# EAGLE design mech433 (EAGLE 9.4.0)
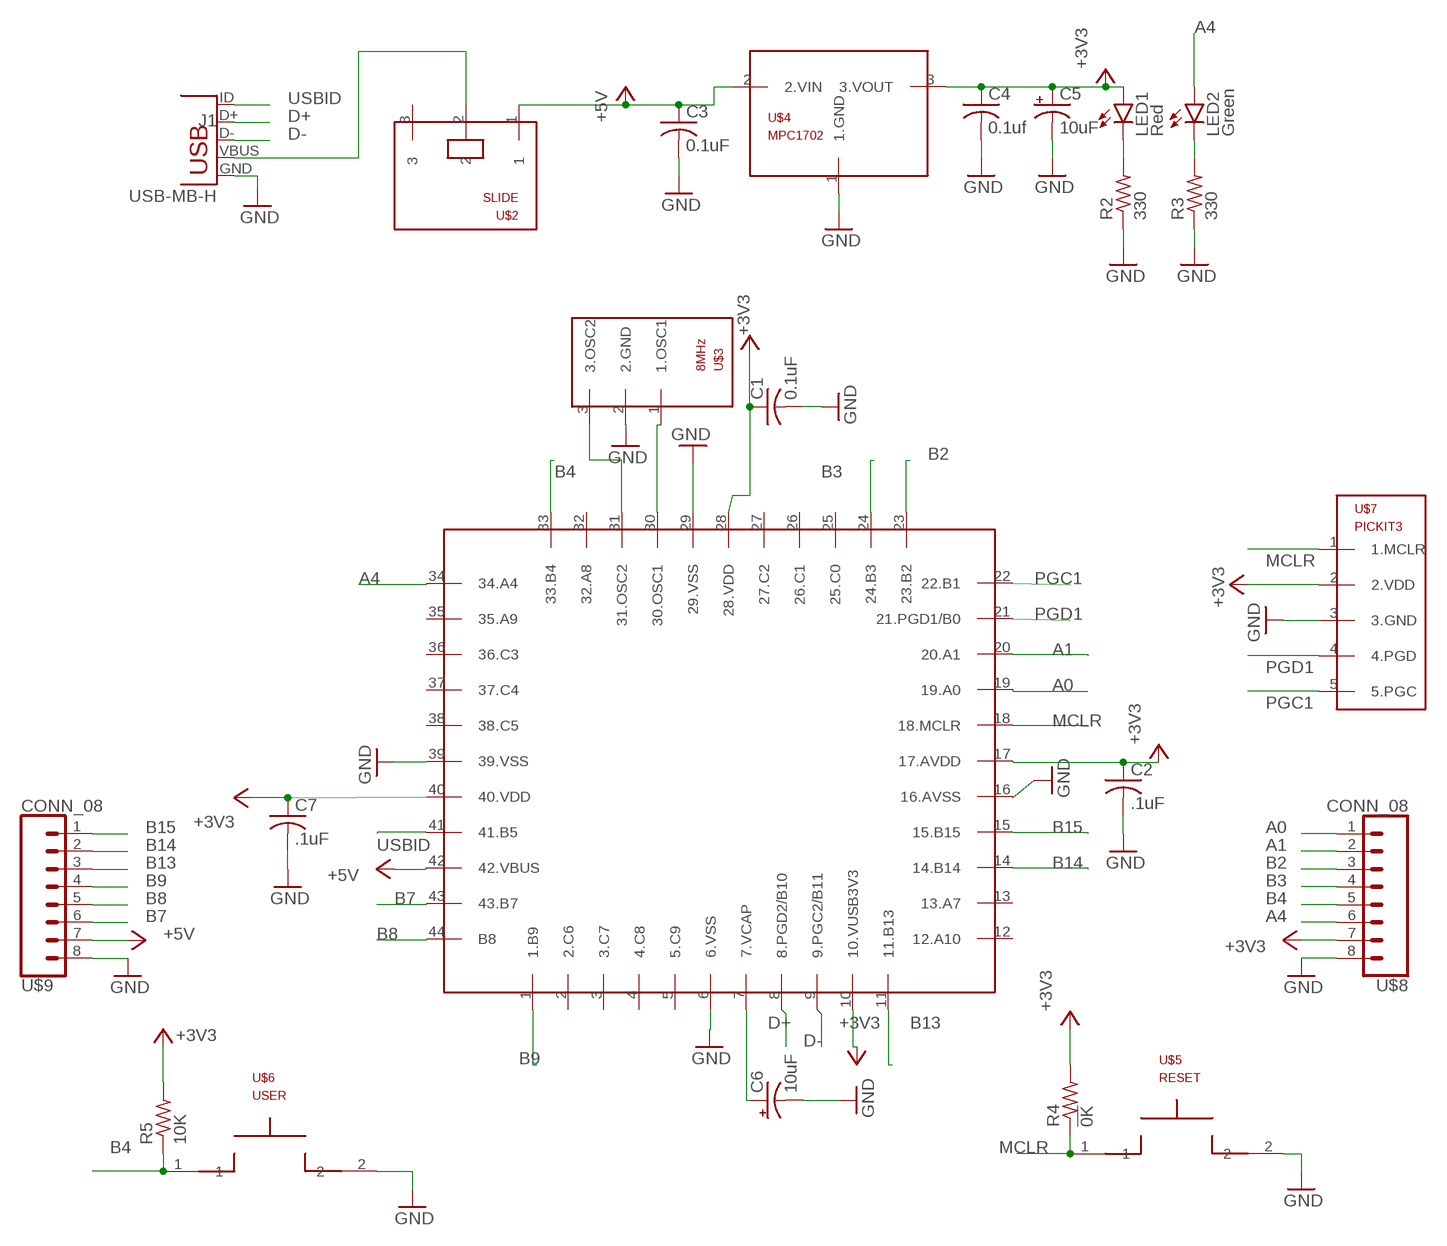
[diagram p0: schematic, sheet 1]

## Parts
C1  0.1uF  C-US025-025X050  [C025-025X050]
C2  .1uF  C-US025-025X050  [C025-025X050]
C3  0.1uF  C-US025-025X050  [C025-025X050]
C4  0.1uf  C-US025-025X050  [C025-025X050]
C5  10uF  CPOL-USB45181B  [B45181B]
C6  10uF  CPOL-USB45181B  [B45181B]
C7  .1uF  C-US025-025X050  [C025-025X050]
J1  USB-MB-H  [USB-MB-H]
LED1  Red  LED3MM  [LED3MM]
LED2  Green  LED3MM  [LED3MM]
R2  330  R-US_0207/10  [0207/10]
R3  330  R-US_0207/10  [0207/10]
R4  !0K  R-US_0207/10  [0207/10]
R5  10K  R-US_0207/10  [0207/10]
U$1  PIC32MX250F256D  [TQFP44]
U$2  SLIDE  [SLIDE]
U$3  8MHz  OSC  [OSC]
U$4  MPC1702  [TO92]
U$5  RESET  PBPB  [PB]
U$6  USER  PBPB  [PB]
U$7  PICKIT3  [1X05]
U$8  CONN_08  [1X08]
U$9  CONN_08  [1X08]

## Nets
+3V3: C1.1 C2.1 C4.1 C5.+ C7.1 LED1.A R4.2 R5.2 U$1.10(10.VUSB3V3) U$1.17(17.AVDD) U$1.28(28.VDD) U$1.40(40.VDD) U$4.3(3.VOUT) U$7.2(2.VDD) U$8.7
+5V: C3.1 U$1.42(42.VBUS) U$2.1 U$4.2(2.VIN) U$9.7
A0: U$1.19(19.A0) U$8.1
A1: U$1.20(20.A1) U$8.2
A4: LED2.A U$1.34(34.A4) U$8.6
B2: U$1.23(23.B2) U$8.3
B3: U$1.24(24.B3) U$8.4
B4: R5.1 U$1.33(33.B4) U$6.1 U$8.5
B7: U$1.43(43.B7) U$9.6
B8: U$1.44(B8) U$9.5
B9: U$1.1(1.B9) U$9.4
B13: U$1.11(11.B13) U$9.3
B14: U$1.14(14.B14) U$9.2
B15: U$1.15(15.B15) U$9.1
D+: J1.D+ U$1.8(8.PGD2/B10)
D-: J1.D- U$1.9(9.PGC2/B11)
GND: C1.2 C2.2 C3.2 C4.2 C5.- C6.- C7.2 J1.GND R2.1 R3.1 U$1.6(6.VSS) U$1.16(16.AVSS) U$1.29(29.VSS) U$1.39(39.VSS) U$3.2(2.GND) U$4.1(1.GND) U$5.2 U$6.2 U$7.3(3.GND) U$8.8 U$9.8
MCLR: R4.1 U$1.18(18.MCLR) U$5.1 U$7.1(1.MCLR)
N$2: LED1.K(C) R2.2
N$3: LED2.K(C) R3.2
N$4: U$1.30(30.OSC1) U$3.1(1.OSC1)
N$5: U$1.31(31.OSC2) U$3.3(3.OSC2)
N$6: C6.+ U$1.7(7.VCAP)
PGC1: U$1.22(22.B1) U$7.5(5.PGC)
PGD1: U$1.21(21.PGD1/B0) U$7.4(4.PGD)
USBID: J1.ID U$1.41(41.B5)
VBUS: J1.VBUS U$2.2
Unconnected: U$1.2(2.C6) U$1.3(3.C7) U$1.4(4.C8) U$1.5(5.C9) U$1.12(12.A10) U$1.13(13.A7) U$1.25(25.C0) U$1.26(26.C1) U$1.27(27.C2) U$1.32(32.A8) U$1.35(35.A9) U$1.36(36.C3) U$1.37(37.C4) U$1.38(38.C5) U$2.3

## Library data of the parts
C1-C4 C7 = mech433:C-US: CAPACITOR, American symbol; SPICEPREFIX: C
C5 C6 = mech433:CPOL-US: POLARIZED CAPACITOR, American symbol; SPICEPREFIX: C
J1 = mech433:USB: USB Connectors USB-B-PTH is fully proven SKU : PRT-00139/CONN-08278 USB-miniB is fully proven SKU : PRT-00587 USB-A-PCB is untested. USB-A-H is throughly reviewed, but untested. Spark Fun Electronics SKU : PRT-00437 USB-B-SMT is throughly reviewed, but untested. Needs silkscreen touching up. USB-A-S has not been used/tested USB-MB-H has not been used/tested USB-MICROB has been used. CONN-09505
LED1 LED2 = led:LED: LED OSRAM: - CHIPLED LG R971, LG N971, LY N971, LG Q971, LY Q971, LO R971, LY R971 LH N974, LH R974 LS Q976, LO Q976, LY Q976 LO Q996 - Hyper CHIPLED LW Q18S LB Q993, LB Q99A, LB R99A - SideLED LS A670, LO A670, LY A670, LG A670, LP A670 LB A673, LV A673, LT A673, LW A673 LH A674 LY A675 LS A676, LA A676, LO A676, LY A676, LW A676 LS A679, LY A679, LG A679 - Hyper Micro SIDELED® LS Y876, LA Y876, LO Y876, LY Y876 LT Y87S - SmartLED LW L88C, LW L88S LB L89C, LB L89S, LG L890 LS L89K, LO L89K, LY L89K LS L896, LA L896, LO L896, LY L896 - TOPLED LS T670, LO T670, LY T670, LG T670, LP T670 LSG T670, LSP T670, LSY T670, LOP T670, LYG T670 LG T671, LOG T671, LSG T671 LB T673, LV T673, LT T673, LW T673 LH T674 LS T676, LA T676, LO T676, LY T676, LB T676, LH T676, LSB T676, LW T676 LB T67C, LV T67C, LT T67C, LS T67K, LO T67K, LY T67K, LW E67C LS E67B, LA E67B, LO E67B, LY E67B, LB E67C, LV E67C, LT E67C LW T67C LS T679, LY T679, LG T679 LS T770, LO T770, LY T770, LG T770, LP T770 LB T773, LV T773, LT T773, LW T773 LH T774 LS E675, LA E675, LY E675, LS T675 LS T776, LA T776, LO T776, LY T776, LB T776 LHGB T686 LT T68C, LB T68C - Hyper Mini TOPLED® LB M676 - Mini TOPLED Santana® LG M470 LS M47K, LO M47K, LY M47K Source: http://www.osram.convergy.de LUXEON: - LUMILED® LXK2-PW12-R00, LXK2-PW12-S00, LXK2-PW14-U00, LXK2-PW14-V00 LXK2-PM12-R00, LXK2-PM12-S00, LXK2-PM14-U00 LXK2-PE12-Q00, LXK2-PE12-R00, LXK2-PE12-S00, LXK2-PE14-T00, LXK2-PE14-U00 LXK2-PB12-K00, LXK2-PB12-L00, LXK2-PB12-M00, LXK2-PB14-N00, LXK2-PB14-P00, LXK2-PB14-Q00 LXK2-PR12-L00, LXK2-PR12-M00, LXK2-PR14-Q00, LXK2-PR14-R00 LXK2-PD12-Q00, LXK2-PD12-R00, LXK2-PD12-S00 LXK2-PH12-R00, LXK2-PH12-S00 LXK2-PL12-P00, LXK2-PL12-Q00, LXK2-PL12-R00 Source: www.luxeon.com KINGBRIGHT: KA-3528ASYC Source: www.kingbright.com
R2-R5 = mech433:R-US_: RESISTOR, American symbol; SPICEPREFIX: R
U$1 = mech433:PIC32MX250F256D
U$2 = mech433:SLIDE
U$3 = mech433:OSC
U$4 = mech433:MPC1702
U$5 U$6 = mech433:PB
U$7 = mech433:PICKIT3
U$8 U$9 = mech433:CONN_08

## Board
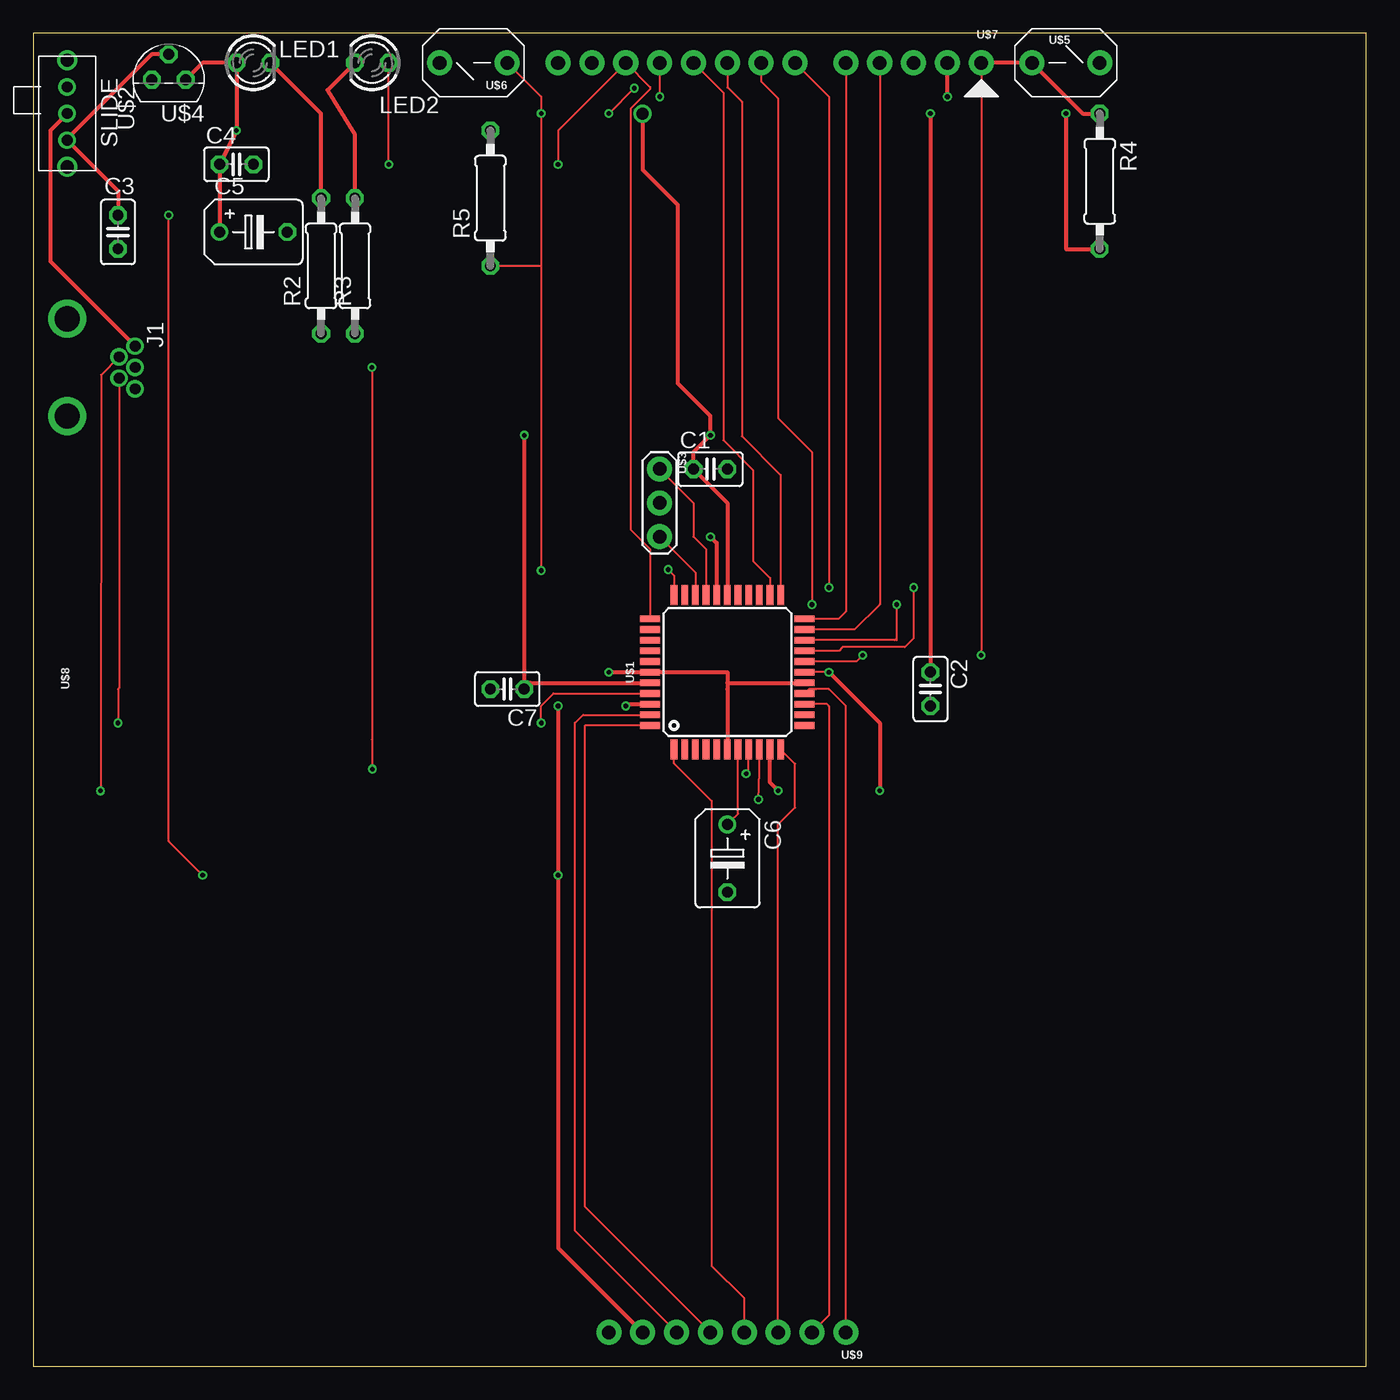
[diagram p1: board, top side]
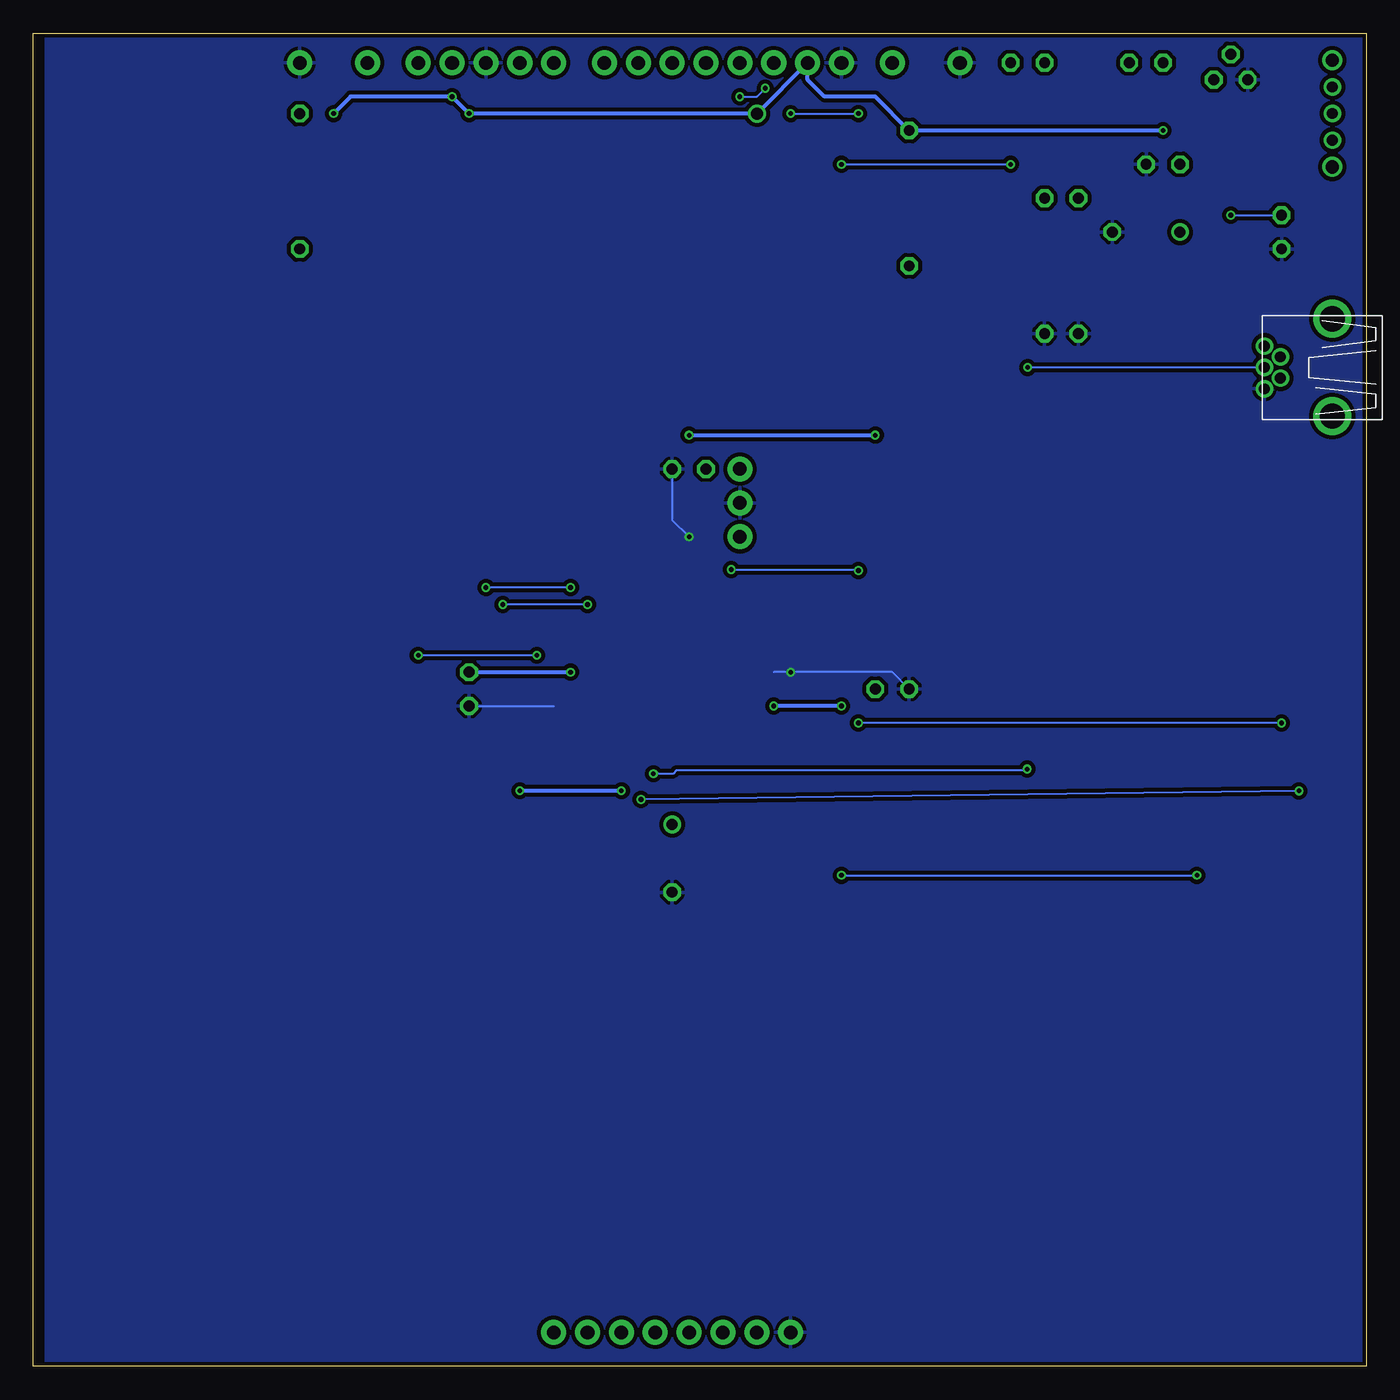
[diagram p2: board, bottom side, seen from below]

Size 100 x 100 mm. Coordinates in mm from the lower left corner, seen from the top.
Outline: 0,0 100,0 100,100 0,100 0,0
Copper layers (1*16): Top 0.035mm / dielectric 1.5mm / Bottom 0.035mm
Design rules "SeeedStudio_2layer_DRU_no_angle_20140221": minimum track width 6mil, minimum drill 12mil, track to track 6mil, track to pad 6mil, pad to pad 6mil, via to via 6mil, smd to smd 0mil, copper to edge 10mil, drill to drill 10mil, minimum pad ring 10mil, minimum via ring 6mil, stop-mask expansion 2mil, vias tented up to drill 100mil, thermal gap 10mil

### Footprints (pad centres in the part's own frame; a part is rotated, then mirrored left to right if it is on the bottom)
C025-025X050 = drill 0.813 octagon: 1 -1.27,0; 2 1.27,0
B45181B = drill 0.813: + -2.54,0 | drill 0.813 octagon: - 2.54,0
USB-MB-H = drill 0.8: D+ 5.1,0; D- 3.9,0.8; GND 5.1,-1.6; ID 3.9,-0.8; VBUS 5.1,1.6 | drill 1.9: P$6 0,-3.65; P$7 0,3.65
LED3MM = drill 0.813 octagon: A -1.27,0; K 1.27,0
0207/10 = drill 0.813 octagon: 1 -5.08,0; 2 5.08,0
TQFP44 = smd 1.5 x 0.5: 1 -5.8,4; 2 -5.8,3.2; 3 -5.8,2.4; 4 -5.8,1.6; 5 -5.8,0.8; 6 -5.8,0; 7 -5.8,-0.8; 8 -5.8,-1.6; 9 -5.8,-2.4; 10 -5.8,-3.2; 11 -5.8,-4; 23 5.8,-4; 24 5.8,-3.2; 25 5.8,-2.4; 26 5.8,-1.6; 27 5.8,-0.8; 28 5.8,0; 29 5.8,0.8; 30 5.8,1.6; 31 5.8,2.4; 32 5.8,3.2; 33 5.8,4 | smd 0.5 x 1.5: 12 -4,-5.8; 13 -3.2,-5.8; 14 -2.4,-5.8; 15 -1.6,-5.8; 16 -0.8,-5.8; 17 0,-5.8; 18 0.8,-5.8; 19 1.6,-5.8; 20 2.4,-5.8; 21 3.2,-5.8; 22 4,-5.8; 34 4,5.8; 35 3.2,5.8; 36 2.4,5.8; 37 1.6,5.8; 38 0.8,5.8; 39 0,5.8; 40 -0.8,5.8; 41 -1.6,5.8; 42 -2.4,5.8; 43 -3.2,5.8; 44 -4,5.8
SLIDE = drill 0.8: 1 -2,0; 2 0,0; 3 2,0 | drill 1: P$1 -4,0; P$2 4,0
OSC = drill 1.016 pad 1.88: 1 -2.54,0; 2 0,0; 3 2.54,0
TO92 = drill 0.813 octagon: 1 -1.27,0; 2 0,1.905; 3 1.27,0
PB = drill 1.016 pad 1.88: 1 -2.54,0; 2 2.54,0
1X05 = drill 1.016 pad 1.88: 1 0,0; 2 2.54,0; 3 5.08,0; 4 7.62,0; 5 10.16,0
1X08 = drill 1.016 pad 1.88: 1 0,0; 2 2.54,0; 3 5.08,0; 4 7.62,0; 5 10.16,0; 6 12.7,0; 7 15.24,0; 8 17.78,0

### Placement (x,y rotation side)
C1  50.8,67.31 0 top
C2  67.31,50.8 270 top
C3  6.35,85.09 270 top
C4  15.24,90.17 0 top
C5  16.51,85.09 0 top
C6  52.07,38.1 270 top
C7  35.56,50.8 180 top
J1  2.54,74.93 0 top
LED1  16.51,97.79 0 top
LED2  25.4,97.79 180 top
R2  21.59,82.55 90 top
R3  24.13,82.55 90 top
R4  80.01,88.9 270 top
R5  34.29,87.63 90 top
U$1  52.07,52.07 90 top
U$2  2.54,93.98 90 top
U$3  46.99,64.77 270 top
U$4  10.16,96.52 0 top
U$5  77.47,97.79 0 top
U$6  33.02,97.79 180 top
U$7  71.12,97.79 180 top
U$8  57.15,97.79 180 top
U$9  60.96,2.54 180 top

### Tracks (layer width: path | path; a pad name or v marks a point on that pad's centre or on a via)
+3V3  (via drill 0.35, 0.9)
  Top 0.152: v59.69,52.07 U$1.17 | C7.1 37.3,51.27
  Top 0.305: U$4.3 12.7,97.79 LED1.A v15.24,92.71 C4.1 C5.+ | v68.58,95.25 U$7.2 | R4.2 77.47,83.82 v77.47,93.98 | v45.72,93.98 45.72,89.76 48.34,87.14 48.34,73.76 50.8,71.3 v50.8,69.85 49.53,68.58 C1.1 52.07,64.77 U$1.28 | v67.31,93.98 C2.1 | v59.69,52.07 63.5,48.26 v63.5,43.18 | v55.88,43.18 55.27,43.79 U$1.10 | v36.83,69.85 C7.1 | 37.3,51.27 U$1.40
  Bottom 0.305: v15.24,92.71 R5.2 36.83,95.25 40.64,95.25 41.91,96.52 U$8.7 v45.72,93.98 v67.31,93.98 v68.58,95.25 76.2,95.25 v77.47,93.98 | C2.1 v59.69,52.07 | v63.5,43.18 v55.88,43.18 | v50.8,69.85 v36.83,69.85
+5V  (via drill 0.35)
  Top 0.152: v44.45,49.53 44.59,49.67 | v12.7,36.83 10.16,39.37 v10.16,86.36
  Top 0.305: U$4.2 8.89,98.42 2.44,91.98 U$2.1 6.35,88.17 C3.1 | v39.37,49.53 v39.37,36.83 39.37,8.89 U$9.7 | 44.59,49.67 U$1.42
  Bottom 0.152: v39.37,36.83 v12.7,36.83 | v10.16,86.36 C3.1
  Bottom 0.305: v39.37,49.53 v44.45,49.53
A0  (via drill 0.35)
  Top 0.152: U$8.1 59.69,95.25 v59.69,58.42 | v66.04,58.42 66.04,54.61 65.38,53.95 60.71,53.95 60.43,53.67 U$1.19
  Bottom 0.152: v59.69,58.42 v66.04,58.42
A1  (via drill 0.35)
  Top 0.152: U$8.2 54.61,96.39 55.88,95.12 55.88,71.12 58.42,68.58 v58.42,57.15 | v64.77,57.15 64.77,54.61 | 64.77,54.61 64.77,54.45 | 64.77,54.61 64.63,54.47 U$1.20
  Bottom 0.152: v58.42,57.15 v64.77,57.15
A4  (via drill 0.35)
  Top 0.152: U$1.34 46.27,61.3 44.82,62.75 44.82,94.35 46.27,95.81 46.27,95.97 U$8.6 39.37,92.71 v39.37,90.17 | v26.67,90.17 LED2.A
  Bottom 0.152: v39.37,90.17 v26.67,90.17
B2
  Top 0.152: U$8.3 52.07,95.95 53.16,94.86 53.16,69.77 56.07,66.86 U$1.23
B3
  Top 0.152: U$8.4 51.77,95.56 51.77,69.47 54,67.23 54,60.41 55.27,59.14 U$1.24
B4  (via drill 0.35)
  Top 0.152: U$6.1 38.1,95.25 v38.1,93.98 38.1,82.55 | 38.1,82.55 R5.1 | U$1.33 48.07,58.38 48.07,59.33 v47.63,59.77 | 38.1,82.55 v38.1,59.69 | U$8.5 v46.99,95.25 | v45.09,95.89 v43.18,93.98
  Bottom 0.152: v38.1,59.69 38.18,59.77 v47.63,59.77 | v46.99,95.25 45.72,95.25 v45.09,95.89 | v43.18,93.98 v38.1,93.98
B7
  Top 0.152: U$9.6 40.64,10.16 40.64,48.26 41.25,48.87 U$1.43
B8
  Top 0.152: U$9.5 41.4,11.94 41.4,48.07 U$1.44 46.25,48.09
B9
  Top 0.152: U$9.4 53.34,5.08 50.88,7.54 50.88,42.42 48.07,45.24 U$1.1
B13
  Top 0.152: U$9.3 55.88,40.64 57.15,41.91 57.15,45.19 U$1.11
B14
  Top 0.152: U$9.2 59.69,3.81 59.69,49.53 59.55,49.67 U$1.14
B15
  Top 0.152: U$9.1 60.96,49.53 59.69,50.8 58.72,50.8 58.72,50.79 58.19,50.79 U$1.15
D+  (via drill 0.35)
  Top 0.152: v25.4,74.93 25.4,46.99 25.43,46.96 v25.43,44.8 | v53.48,44.45 53.63,44.6 53.63,46.23 U$1.8
  Bottom 0.152: J1.D+ v25.4,74.93 | v25.43,44.8 25.52,44.72 51.76,44.72 52.02,44.45 v53.48,44.45
D-  (via drill 0.35)
  Top 0.152: J1.D- 5.08,74.37 v5.05,43.16 | v54.41,42.52 54.47,44.57 U$1.9
  Bottom 0.152: v5.05,43.16 v54.41,42.52
GND  (via drill 0.35)
  Top 0.152: U$1.16 | U$1.6
  Top 0.305: v50.8,62.23 51.27,61.76 U$1.29 | v43.18,52.07 U$1.39 52.07,52.07 52.07,51.26 | U$1.6 52.07,50.8 52.07,51.26 | 52.07,51.26 U$1.16
  Bottom 0.152: C2.2 60.96,49.53 | C1.2 52.07,63.5 v50.8,62.23 | C7.2 35.56,52.07 v43.18,52.07 44.45,52.07
  pour Bottom (isolate 0.305): 0,100.33 0,0 99.06,0 99.06,100.33
MCLR  (via drill 0.35)
  Top 0.152: U$7.1 v71.12,53.34 | v62.23,53.34 61.76,52.87 U$1.18
  Top 0.305: R4.1 78.74,93.98 U$5.1 U$7.1
  Bottom 0.152: v71.12,53.34 v62.23,53.34
N$2
  Top 0.305: R2.2 21.59,93.98 LED1.K
N$3
  Top 0.305: LED2.K 22.07,95.73 24.13,92.41 R3.2
N$4
  Top 0.152: U$3.1 49.53,64.77 49.53,62.23 50.47,61.29 U$1.30
N$5
  Top 0.152: U$3.3 49.67,59.55 U$1.31
N$6
  Top 0.152: C6.+ 52.87,41.44 U$1.7
PGC1
  Top 0.152: U$7.5 60.96,56.62 60.41,56.07 U$1.22
PGD1
  Top 0.152: U$7.4 63.5,57.15 61.62,55.27 U$1.21
USBID  (via drill 0.35)
  Top 0.152: J1.ID 6.44,50.89 6.35,50.8 v6.35,48.26 | v38.1,48.26 38.1,49.54 39.03,50.47 U$1.41
  Bottom 0.152: v6.35,48.26 v38.1,48.26
VBUS
  Top 0.305: U$2.2 1.27,92.71 1.27,82.9 J1.VBUS